# EAGLE design CapGrid4x4V1-partialroute2 (EAGLE 6.5.0)
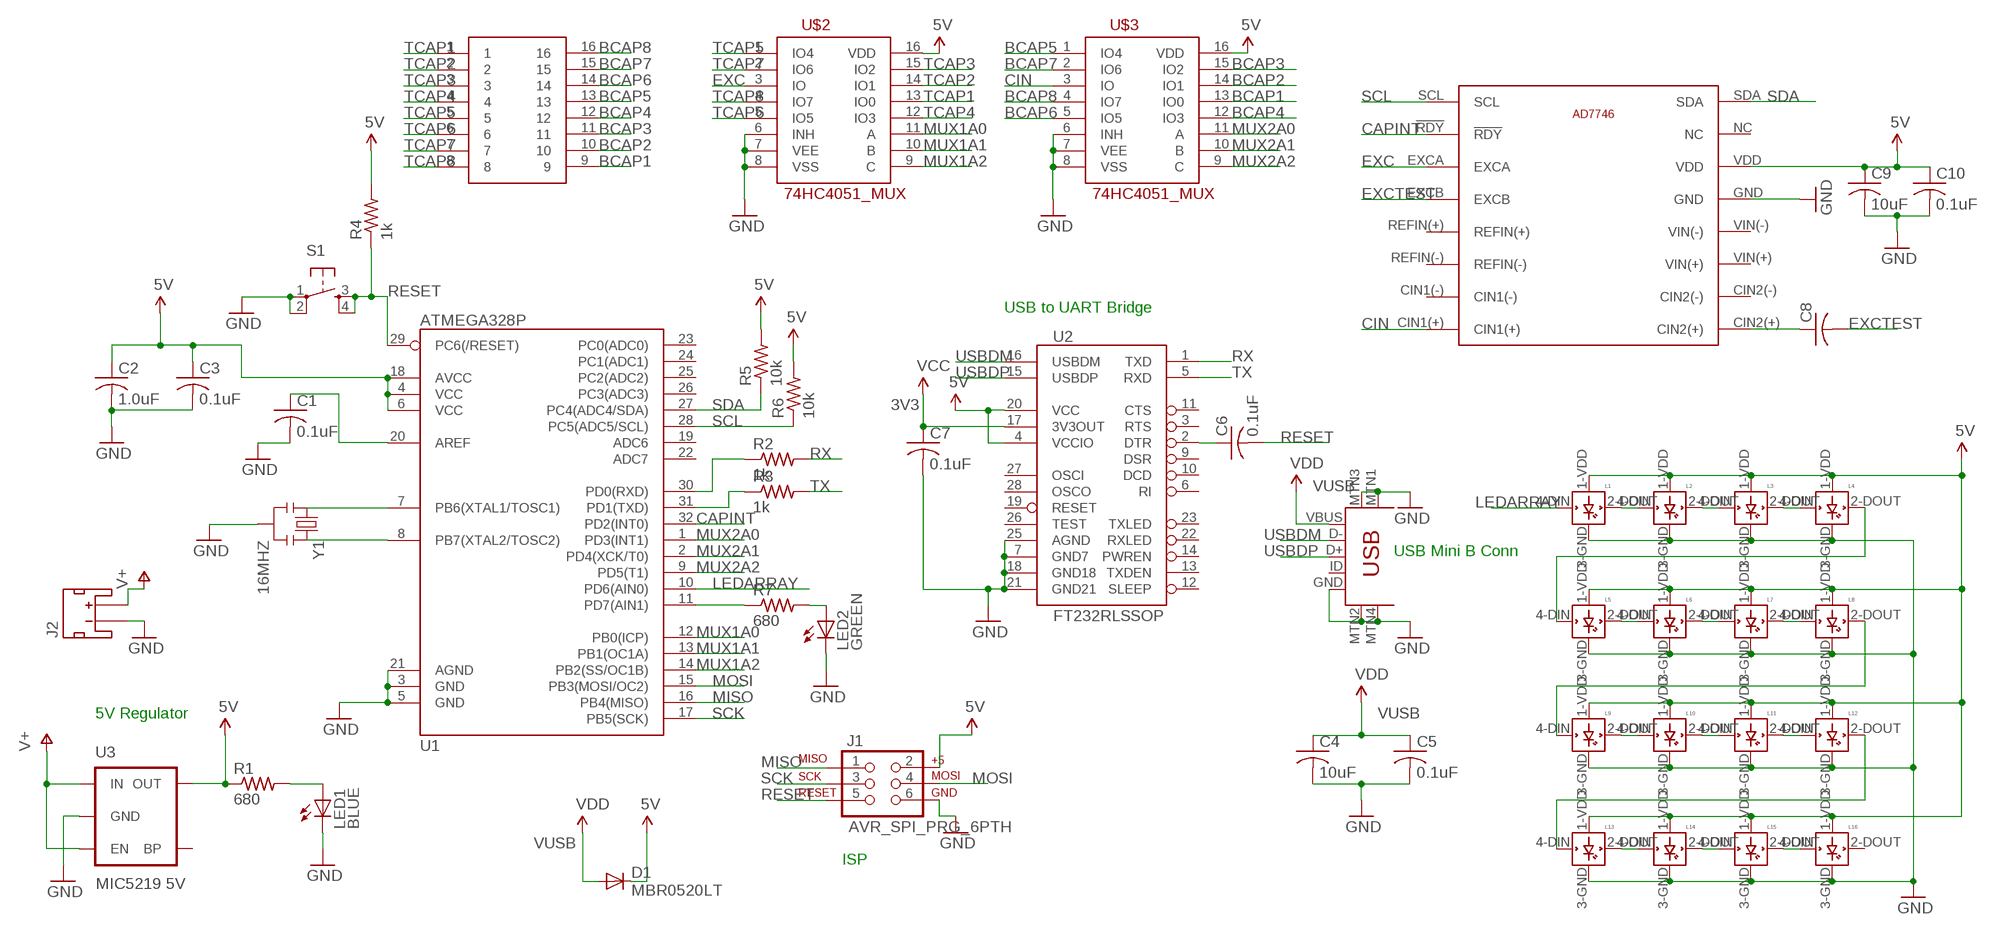
[diagram p0: schematic, sheet 1]

## Parts
C1  0.1uF  C-USC0805K  [C0805K]
C2  1.0uF  C-USC0805K  [C0805K]
C3  0.1uF  C-USC0805K  [C0805K]
C4  10uF  C-USC0805K  [C0805K]
C5  0.1uF  C-USC0805K  [C0805K]
C6  0.1uF  C-USC0805K  [C0805K]
C7  0.1uF  C-USC0805K  [C0805K]
C8  C-US025-025X050  [C025-025X050]
C9  10uF  C-USC0805K  [C0805K]
C10  0.1uF  C-USC0805K  [C0805K]
D1  MBR0520LT  [SOD123]
J1  AVR_SPI_PRG_6PTH  [2X3]
J2  JST_2MM_MALE  [JST-2-SMD]
L1  WS2812B  [WS2812B]
L2  WS2812B  [WS2812B]
L3  WS2812B  [WS2812B]
L4  WS2812B  [WS2812B]
L5  WS2812B  [WS2812B]
L6  WS2812B  [WS2812B]
L7  WS2812B  [WS2812B]
L8  WS2812B  [WS2812B]
L9  WS2812B  [WS2812B]
L10  WS2812B  [WS2812B]
L11  WS2812B  [WS2812B]
L12  WS2812B  [WS2812B]
L13  WS2812B  [WS2812B]
L14  WS2812B  [WS2812B]
L15  WS2812B  [WS2812B]
L16  WS2812B  [WS2812B]
LED1  BLUE  LEDCHIP-LED0805  [CHIP-LED0805]
LED2  GREEN  LEDCHIP-LED0805  [CHIP-LED0805]
R1  680  R-US_R0805  [R0805]
R2  1k  R-US_R0805  [R0805]
R3  1k  R-US_R0805  [R0805]
R4  1k  R-US_R0805  [R0805]
R5  10k  R-US_R0805  [R0805]
R6  10k  R-US_R0805  [R0805]
R7  680  R-US_R0805  [R0805]
S1  TAC_SWITCHSMD  [TACTILE-SWITCH-SMD]
U1  ATMEGA328P  ATMEGA328_SMT  [TQFP32-08]
U2  FT232RLSSOP  [SSOP28DB]
U3  MIC5219 5V  V_REG_MIC52195V  [SOT23-5]
U$1  USB-MINIB-5PIN  [USB-MINIB]
U$2  74HC4051_MUX  [SO16]
U$3  74HC4051_MUX  [SO16]
U$4  AD7746  [AD7746]
U$5  CAP8CONN  [CAP8CONN]
Y1  16MHZ  RESONATOR16MHZ  [RESONATOR-SMD]

## Nets
3V3: C7.1 U2.17(3V3OUT) ; supply symbol labelled VCC
5V: C2.1 C3.1 C9.1 C10.1 D1.C J1.2 L1.1-VDD(VDD) L2.1-VDD(VDD) L3.1-VDD(VDD) L4.1-VDD(VDD) L5.1-VDD(VDD) L6.1-VDD(VDD) L7.1-VDD(VDD) L8.1-VDD(VDD) L9.1-VDD(VDD) L10.1-VDD(VDD) L11.1-VDD(VDD) L12.1-VDD(VDD) L13.1-VDD(VDD) L14.1-VDD(VDD) L15.1-VDD(VDD) L16.1-VDD(VDD) R1.1 R4.2 R5.2 R6.2 U1.4(VCC) U1.6(VCC) U1.18(AVCC) U2.4(VCCIO) U2.20(VCC) U3.5(OUT) U$2.16(VDD) U$3.16(VDD) U$4.VDD
BCAP1: U$3.13(IO0) U$5.9
BCAP2: U$3.14(IO1) U$5.10
BCAP3: U$3.15(IO2) U$5.11
BCAP4: U$3.12(IO3) U$5.12
BCAP5: U$3.1(IO4) U$5.13
BCAP6: U$3.5(IO5) U$5.14
BCAP7: U$3.2(IO6) U$5.15
BCAP8: U$3.4(IO7) U$5.16
CAPINT: U1.32(PD2(INT0)) U$4.!RDY
CIN: U$3.3(IO) U$4.CIN1(+)
EXC: U$2.3(IO) U$4.EXCA
EXCTEST: C8.2 U$4.EXCB
GND: C1.2 C2.2 C3.2 C4.2 C5.2 C7.2 C9.2 C10.2 J1.6 J2.1(-) L1.3-GND(GND) L2.3-GND(GND) L3.3-GND(GND) L4.3-GND(GND) L5.3-GND(GND) L6.3-GND(GND) L7.3-GND(GND) L8.3-GND(GND) L9.3-GND(GND) L10.3-GND(GND) L11.3-GND(GND) L12.3-GND(GND) L13.3-GND(GND) L14.3-GND(GND) L15.3-GND(GND) L16.3-GND(GND) LED1.C LED2.C S1.1 S1.2 U1.3(GND) U1.5(GND) U1.21(AGND) U2.7(GND7) U2.18(GND18) U2.21(GND21) U2.25(AGND) U3.2(GND) U$1.GND U$1.MTN1(MTN2) U$1.MTN2(MTN3) U$1.MTN3(MTN1) U$1.MTN4 U$2.6(INH) U$2.7(VEE) U$2.8(VSS) U$3.6(INH) U$3.7(VEE) U$3.8(VSS) U$4.GND Y1.2
LEDARRAY: L1.4-DIN(DIN) U1.10(PD6(AIN0))
MISO: J1.1 U1.16(PB4(MISO))
MOSI: J1.4 U1.15(PB3(MOSI/OC2))
MUX1A0: U1.12(PB0(ICP)) U$2.11(A)
MUX1A1: U1.13(PB1(OC1A)) U$2.10(B)
MUX1A2: U1.14(PB2(SS/OC1B)) U$2.9(C)
MUX2A0: U1.1(PD3(INT1)) U$3.11(A)
MUX2A1: U1.2(PD4(XCK/T0)) U$3.10(B)
MUX2A2: U1.9(PD5(T1)) U$3.9(C)
N$1: R2.1 U1.30(PD0(RXD))
N$2: C6.1 U2.2(DTR)
N$3: R3.1 U1.31(PD1(TXD))
N$4: U1.7(PB6(XTAL1/TOSC1)) Y1.1
N$5: R7.1 U1.11(PD7(AIN1))
N$6: U1.8(PB7(XTAL2/TOSC2)) Y1.3
N$7: C1.1 U1.20(AREF)
N$8: LED1.A R1.2
N$9: LED2.A R7.2
N$10: L4.2-DOUT(DOUT) L5.4-DIN(DIN)
N$11: L10.2-DOUT(DOUT) L11.4-DIN(DIN)
N$14: L1.2-DOUT(DOUT) L2.4-DIN(DIN)
N$15: L2.2-DOUT(DOUT) L3.4-DIN(DIN)
N$16: L3.2-DOUT(DOUT) L4.4-DIN(DIN)
N$18: L5.2-DOUT(DOUT) L6.4-DIN(DIN)
N$19: L6.2-DOUT(DOUT) L7.4-DIN(DIN)
N$20: L7.2-DOUT(DOUT) L8.4-DIN(DIN)
N$21: L8.2-DOUT(DOUT) L9.4-DIN(DIN)
N$22: L9.2-DOUT(DOUT) L10.4-DIN(DIN)
N$24: L11.2-DOUT(DOUT) L12.4-DIN(DIN)
N$25: L12.2-DOUT(DOUT) L13.4-DIN(DIN)
N$26: L13.2-DOUT(DOUT) L14.4-DIN(DIN)
N$27: L14.2-DOUT(DOUT) L15.4-DIN(DIN)
N$28: L15.2-DOUT(DOUT) L16.4-DIN(DIN)
N$29: C8.1 U$4.CIN2(+)
RESET: C6.2 J1.5 R4.1 S1.3 S1.4 U1.29(PC6(/RESET))
RX: R2.2 U2.1(TXD)
SCK: J1.3 U1.17(PB5(SCK))
SCL: R6.1 U1.28(PC5(ADC5/SCL)) U$4.SCL
SDA: R5.1 U1.27(PC4(ADC4/SDA)) U$4.SDA
TCAP1: U$2.13(IO0) U$5.1
TCAP2: U$2.14(IO1) U$5.2
TCAP3: U$2.15(IO2) U$5.3
TCAP4: U$2.12(IO3) U$5.4
TCAP5: U$2.1(IO4) U$5.5
TCAP6: U$2.5(IO5) U$5.6
TCAP7: U$2.2(IO6) U$5.7
TCAP8: U$2.4(IO7) U$5.8
TX: R3.2 U2.5(RXD)
USBDM: U2.16(USBDM) U$1.D-
USBDP: U2.15(USBDP) U$1.D+
V+: J2.2(+) U3.1(IN) U3.3(EN)
VUSB: C4.1 C5.1 D1.A U$1.VBUS ; supply symbol labelled VDD
Unconnected: J2.NC1(PAD1) J2.NC2(PAD2) L16.2-DOUT(DOUT) U1.19(ADC6) U1.22(ADC7) U1.23(PC0(ADC0)) U1.24(PC1(ADC1)) U1.25(PC2(ADC2)) U1.26(PC3(ADC3)) U2.3(RTS) U2.6(RI) U2.9(DSR) U2.10(DCD) U2.11(CTS) U2.12(SLEEP) U2.13(TXDEN) U2.14(PWREN) U2.19(RESET) U2.22(RXLED) U2.23(TXLED) U2.26(TEST) U2.27(OSCI) U2.28(OSCO) U3.4(BP) U$1.ID U$4.CIN1(-) U$4.CIN2(-) U$4.NC U$4.REFIN(+) U$4.REFIN(-) U$4.VIN(+) U$4.VIN(-)

## Notes on the sheet
- USB to UART Bridge
- USB Mini B Conn
- 5V Regulator
- ISP

## Library data of the parts
C1 C3 C5-C7 C10 = adafruit:C-US: CAPACITOR, American symbol; MPN: 08055C104KAZ2A; OC_NEWARK: 10R5976
C2 = adafruit:C-US: CAPACITOR, American symbol; MF: KEMET; MPN: C0805C105M4RACTU; OC_NEWARK: 42H5473
C4 C9 = adafruit:C-US: CAPACITOR, American symbol; MPN: C2012X5R1A106K125AB; OC_NEWARK: 04X3268
C8 = adafruit:C-US: CAPACITOR, American symbol; OC_NEWARK: unknown
D1 = diode:MBR0520LT: SCHOTTKY BARRIER RECTIFIER Source: http://onsemi.com .. MBR0520LT1-D.pdf; MF: ON SEMICONDUCTOR; MPN: MBR0520LT1G; OC_NEWARK: 48K7498
J1 = SparkFun-Connectors:AVR_SPI_PRG_6: AVR ISP 6 Pin This is the reduced ISP connector for AVR programming. Common on Arduino. This footprint will take up less PCB space and can be used with a 10-pin to 6-pin adapter such as SKU: BOB-08508 **Special note about "TEST_POINT" package. The stop mask is on the top side, so if you want your programming test points to be on the bottom of your board, make sure to place this package on the bottom side of the board. This also ensure that the orientation to program from the bottom side will be correct.; OC_NEWARK: unknown
J2 = SparkFun-Connectors:JST_2MM_MALE: Mates to single-cell LiPo batteries. CONN-08352; MF: FARNELL; MPN: S2B-PH-SM4-TB(LF)(SN); OC_NEWARK: 38K8067; PROD_ID: CONN-08352
L1-L16 = adafruit:WS2812B; OC_NEWARK: unknown
LED1 = adafruit:LED: LED OSRAM: - CHIPLED LG R971, LG N971, LY N971, LG Q971, LY Q971, LO R971, LY R971 LH N974, LH R974 LS Q976, LO Q976, LY Q976 LO Q996 - Hyper CHIPLED LW Q18S LB Q993, LB Q99A, LB R99A - SideLED LS A670, LO A670, LY A670, LG A670, LP A670 LB A673, LV A673, LT A673, LW A673 LH A674 LY A675 LS A676, LA A676, LO A676, LY A676, LW A676 LS A679, LY A679, LG A679 - Hyper Micro SIDELED® LS Y876, LA Y876, LO Y876, LY Y876 LT Y87S - SmartLED LW L88C, LW L88S LB L89C, LB L89S, LG L890 LS L89K, LO L89K, LY L89K LS L896, LA L896, LO L896, LY L896 - TOPLED LS T670, LO T670, LY T670, LG T670, LP T670 LSG T670, LSP T670, LSY T670, LOP T670, LYG T670 LG T671, LOG T671, LSG T671 LB T673, LV T673, LT T673, LW T673 LH T674 LS T676, LA T676, LO T676, LY T676, LB T676, LH T676, LSB T676, LW T676 LB T67C, LV T67C, LT T67C, LS T67K, LO T67K, LY T67K, LW E67C LS E67B, LA E67B, LO E67B, LY E67B, LB E67C, LV E67C, LT E67C LW T67C LS T679, LY T679, LG T679 LS T770, LO T770, LY T770, LG T770, LP T770 LB T773, LV T773, LT T773, LW T773 LH T774 LS E675, LA E675, LY E675, LS T675 LS T776, LA T776, LO T776, LY T776, LB T776 LHGB T686 LT T68C, LB T68C - Hyper Mini TOPLED® LB M676 - Mini TOPLED Santana® LG M470 LS M47K, LO M47K, LY M47K Source: http://www.osram.convergy.de/; MF: SLI (CML/IDI); MPN: CMD17-21VRC/TR8; OC_NEWARK: 34C8663
LED2 = adafruit:LED: LED OSRAM: - CHIPLED LG R971, LG N971, LY N971, LG Q971, LY Q971, LO R971, LY R971 LH N974, LH R974 LS Q976, LO Q976, LY Q976 LO Q996 - Hyper CHIPLED LW Q18S LB Q993, LB Q99A, LB R99A - SideLED LS A670, LO A670, LY A670, LG A670, LP A670 LB A673, LV A673, LT A673, LW A673 LH A674 LY A675 LS A676, LA A676, LO A676, LY A676, LW A676 LS A679, LY A679, LG A679 - Hyper Micro SIDELED® LS Y876, LA Y876, LO Y876, LY Y876 LT Y87S - SmartLED LW L88C, LW L88S LB L89C, LB L89S, LG L890 LS L89K, LO L89K, LY L89K LS L896, LA L896, LO L896, LY L896 - TOPLED LS T670, LO T670, LY T670, LG T670, LP T670 LSG T670, LSP T670, LSY T670, LOP T670, LYG T670 LG T671, LOG T671, LSG T671 LB T673, LV T673, LT T673, LW T673 LH T674 LS T676, LA T676, LO T676, LY T676, LB T676, LH T676, LSB T676, LW T676 LB T67C, LV T67C, LT T67C, LS T67K, LO T67K, LY T67K, LW E67C LS E67B, LA E67B, LO E67B, LY E67B, LB E67C, LV E67C, LT E67C LW T67C LS T679, LY T679, LG T679 LS T770, LO T770, LY T770, LG T770, LP T770 LB T773, LV T773, LT T773, LW T773 LH T774 LS E675, LA E675, LY E675, LS T675 LS T776, LA T776, LO T776, LY T776, LB T776 LHGB T686 LT T68C, LB T68C - Hyper Mini TOPLED® LB M676 - Mini TOPLED Santana® LG M470 LS M47K, LO M47K, LY M47K Source: http://www.osram.convergy.de/; MF: SLI (CML/IDI); MPN: CMD17-21VGC/TR8; OC_NEWARK: 34C8661
R1 R7 = adafruit:R-US_: RESISTOR, American symbol; MPN: ERJ-6ENF6800V; OC_NEWARK: 64R5419
R2-R4 = adafruit:R-US_: RESISTOR, American symbol; MF: VISHAY/DALE; MPN: CRCW08051K00FKTA; OC_NEWARK: 05F1507
R5 R6 = adafruit:R-US_: RESISTOR, American symbol; MF: VISHAY/DALE; MPN: CRCW080510K0FKEA; OC_NEWARK: 52K9795
S1 = SparkFun-Electromechanical:TAC_SWITCH: Momentary Switch Button commonly used for reset or general input. Spark Fun Electronics SKU : COM-00097 SMT- SWCH-08247; MPN: MC32845; OC_NEWARK: 67P3626
U1 = SparkFun-DigitalIC:ATMEGA328_SMT: 32-Pin Atmega328 part Commonly used on Arduino compatible boards Available in QFP and QFN packages TQFP is IC-09069 QFN is non-stock; MPN: ATMEGA328P-AU; OC_NEWARK: 68T2935; PROD_ID: IC-09069
U2 = SparkFun-DigitalIC:FT232RL: USB UART FT232RL 4th Generation USB UART (USB <-> Serial) Controller. Spark Fun Electronics SKU : COM-00650 Production SKU IC-00870; MPN: FT232RL; OC_NEWARK: 91K9918; PROD_ID: IC-00870
U3 = SparkFun-PowerIC:V_REG_MIC5219: V_REG MIC5219 Standard 3.3V and 5V 500mA LDO voltage regulator in SOT-23 layout. Micrel part MIC5219. BP (by-pass) pin is used to lower output noise with 470pF cap, may be left open.; OC_NEWARK: unknown; PROD_ID: VREG-10107
U$1 = SparkFun-Connectors:USB-MINIB: Mini-USB "B" connector with 5th pin broken out. Created new symbol breaking out 5th "ID" pin in mini/micro USB connector spec. See: http://en.wikipedia.org/wiki/Mini_usb#Cables. Uses same footprint as 4-pin symbol. Also added pins to connect to mounting / shield pads if required (probably not generally needed as signals aren't shielded once they leave the connector).; MPN: 67503-1230; OC_NEWARK: 88W2531
U$2 U$3 = SparkFun-AnalogIC:74HC4051_MUX: 8:1 analog mux; OC_NEWARK: unknown
U$4 = SBLib:AD7746; MPN: AD7746ARUZ; OC_NEWARK: 19M0895
U$5 = SBLib:CAP8CONN; OC_NEWARK: unknown
Y1 = SparkFun-FreqCtrl:RESONATOR: Resonator Small SMD resonator. Used, eg, on the Arduino Pro/ Pro Mini boards. 8MHz- XTAL-08895 16MHz- XTAL-08900; MPN: PBRC16.00MR70X000; OC_NEWARK: 11N7357; PROD_ID: XTAL-08900

## Net classes
0 default: width 0.152 mm, drill 0.33 mm, clearance 0.178 mm

## Board
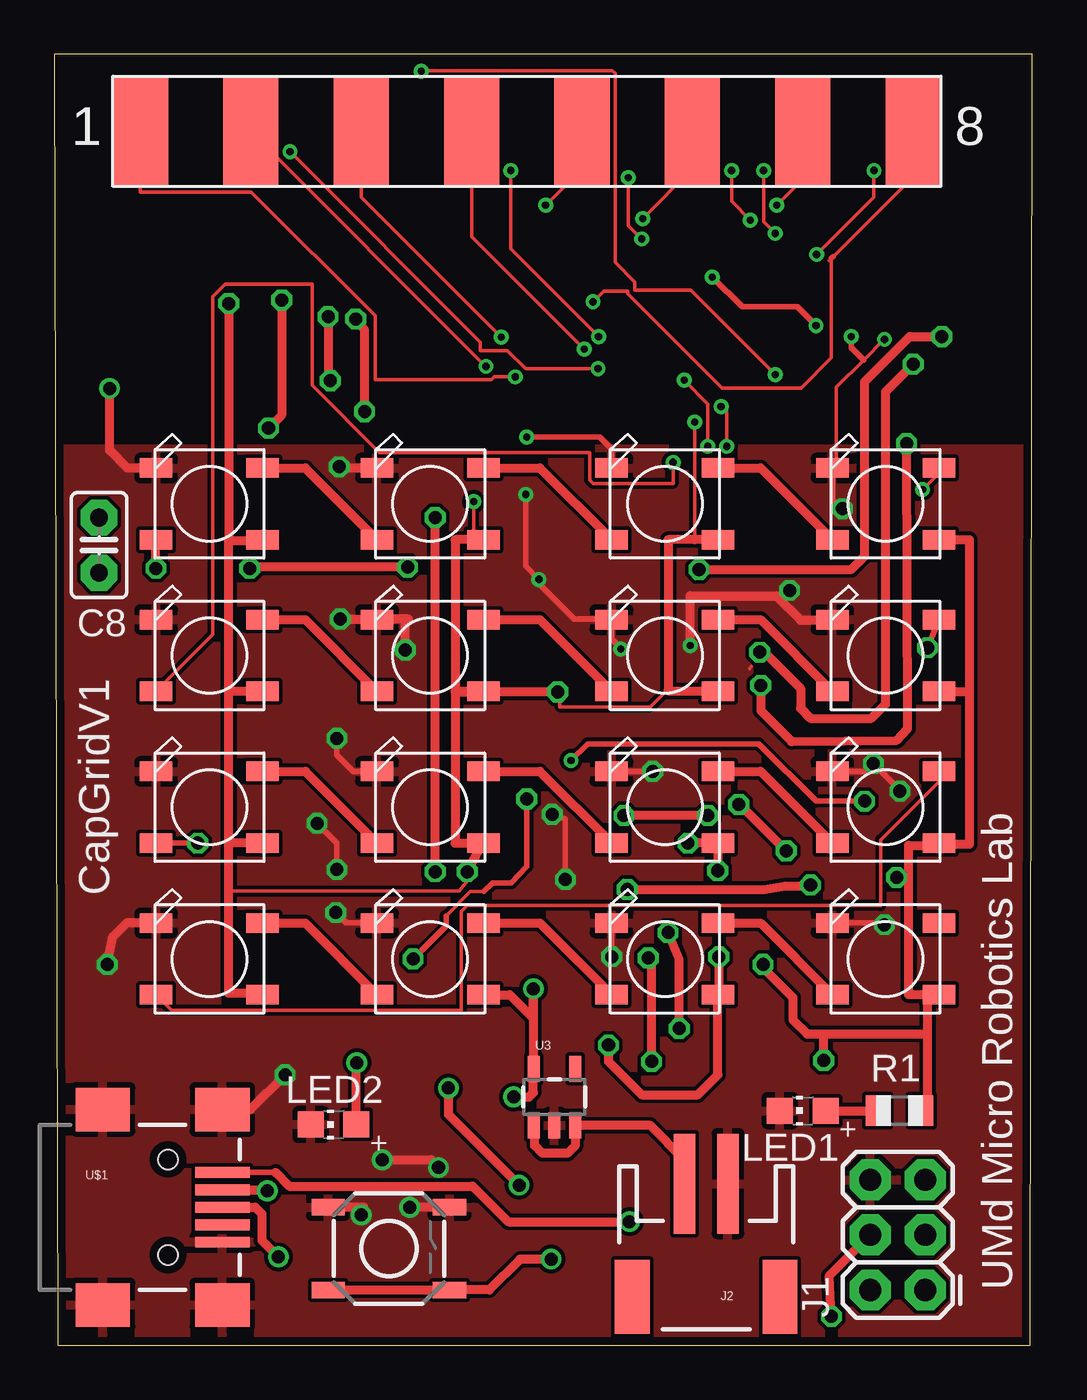
[diagram p1: board, top side]
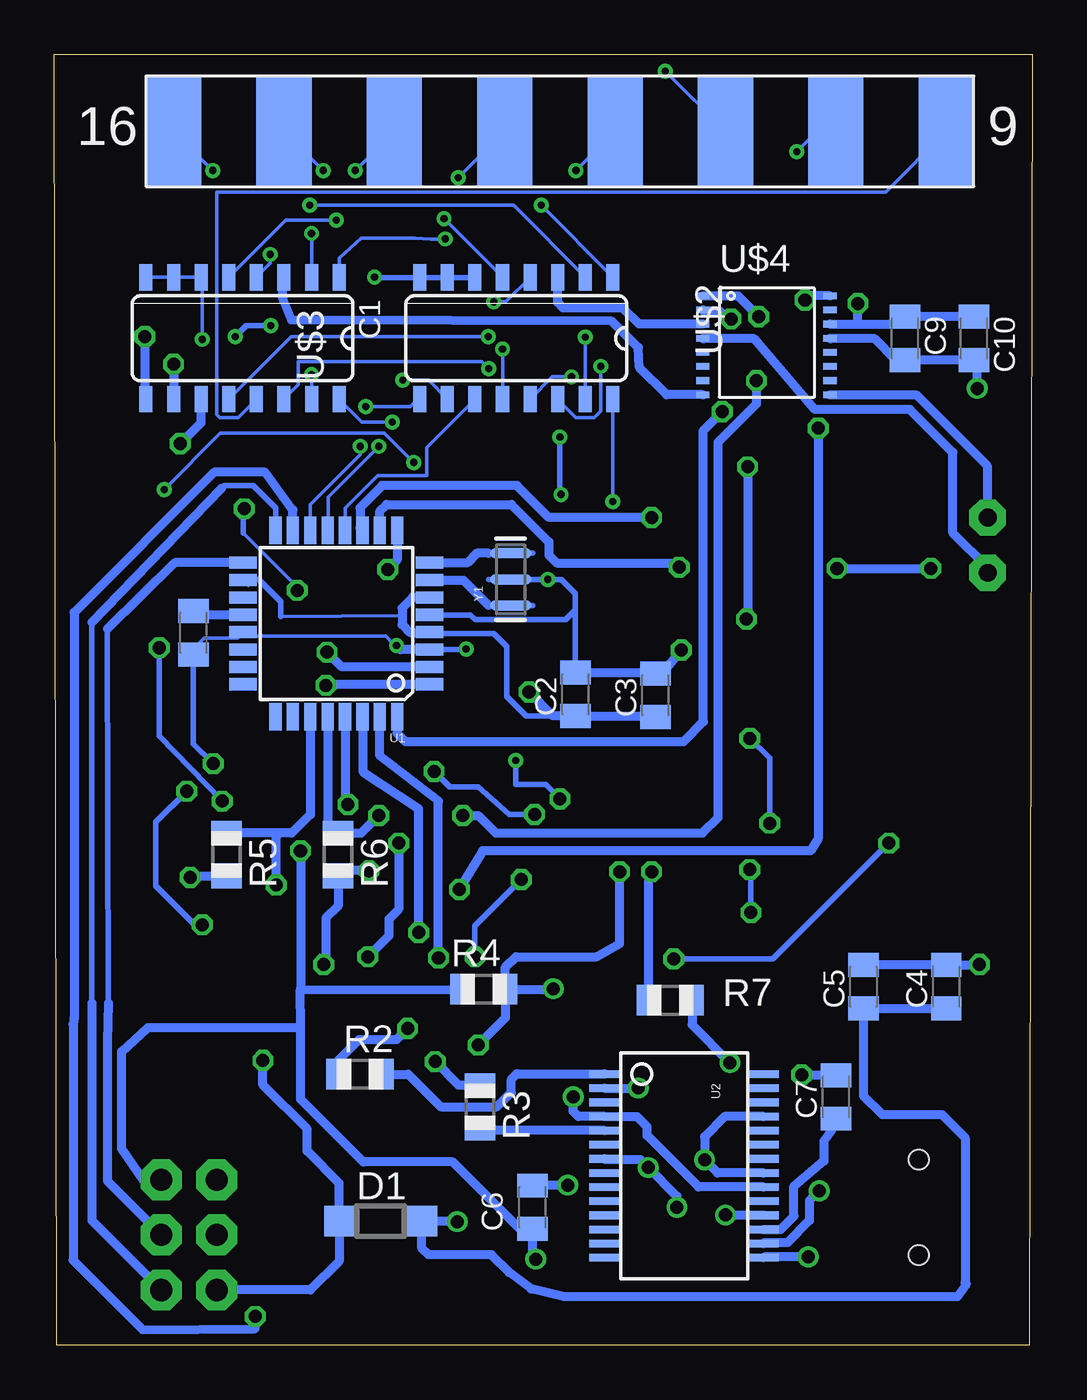
[diagram p2: board, bottom side, seen from below]

Size 45.01 x 59.43 mm. Coordinates in mm from the lower left corner, seen from the top.
Outline: 0.15,0 44.91,0 45.01,59.43 0,59.43 0.15,0
Copper layers (1*16): Top 0.0356mm / dielectric 1.5011mm / Bottom 0.0356mm
Design rules "LaenPCBOrder": minimum track width 6mil, minimum drill 13mil, track to track 6mil, track to pad 6mil, pad to pad 6mil, via to via 6mil, smd to smd 6mil, copper to edge 15mil, drill to drill 6mil, minimum pad ring 7mil, minimum via ring 7mil, stop-mask expansion 3mil, vias tented up to drill 0mil, thermal gap 10mil

### Footprints (pad centres in the part's own frame; a part is rotated, then mirrored left to right if it is on the bottom)
C0805K = smd 1.1 x 1.4: 1 -1,0; 2 1,0
C025-025X050 = drill 0.813 pad 1.676 octagon: 1 -1.27,0; 2 1.27,0
SOD123 = smd 1.4 x 1.4: A 1.9,0; C -1.9,0
2X3 = drill 1.016 pad 1.88 octagon: 1 0,0; 2 0,2.54; 3 2.54,0; 4 2.54,2.54; 5 5.08,0; 6 5.08,2.54
JST-2-SMD = smd 1 x 4.6: 1 -1,-3.7; 2 1,-3.7 | smd 1.6 x 3.4: NC1 -3.4,1.5; NC2 3.4,1.5
WS2812B = smd 1.5 x 0.9: 1-VDD 2.45,-1.65; 2-DOUT 2.45,1.65; 3-GND -2.45,1.65; 4-DIN -2.45,-1.65
CHIP-LED0805 = smd 1.2 x 1.2: A 0,-1.05; C 0,1.05
R0805 = smd 1.1 x 1.4: 1 -1,0; 2 1,0
TACTILE-SWITCH-SMD = smd 1.524 x 0.762: 1 -2.794,1.905; 2 2.794,1.905; 3 -2.794,-1.905; 4 2.794,-1.905
TQFP32-08 = smd 1.27 x 0.559: 1 -4.293,2.8; 2 -4.293,2; 3 -4.293,1.2; 4 -4.293,0.4; 5 -4.293,-0.4; 6 -4.293,-1.2; 7 -4.293,-2; 8 -4.293,-2.8; 17 4.293,-2.8; 18 4.293,-2; 19 4.293,-1.2; 20 4.293,-0.4; 21 4.293,0.4; 22 4.293,1.2; 23 4.293,2; 24 4.293,2.8 | smd 0.559 x 1.27: 9 -2.8,-4.293; 10 -2,-4.293; 11 -1.2,-4.293; 12 -0.4,-4.293; 13 0.4,-4.293; 14 1.2,-4.293; 15 2,-4.293; 16 2.8,-4.293; 25 2.8,4.293; 26 2,4.293; 27 1.2,4.293; 28 0.4,4.293; 29 -0.4,4.293; 30 -1.2,4.293; 31 -2,4.293; 32 -2.8,4.293
SSOP28DB = smd 0.348 x 1.397: 1 -4.225,-3.656; 2 -3.575,-3.656; 3 -2.925,-3.656; 4 -2.275,-3.656; 5 -1.625,-3.656; 6 -0.975,-3.656; 7 -0.325,-3.656; 8 0.325,-3.656; 9 0.975,-3.656; 10 1.625,-3.656; 11 2.275,-3.656; 12 2.925,-3.656; 13 3.575,-3.656; 14 4.225,-3.656; 15 4.225,3.656; 16 3.575,3.656; 17 2.925,3.656; 18 2.275,3.656; 19 1.625,3.656; 20 0.975,3.656; 21 0.325,3.656; 22 -0.325,3.656; 23 -0.975,3.656; 24 -1.625,3.656; 25 -2.275,3.656; 26 -2.925,3.656; 27 -3.575,3.656; 28 -4.225,3.656
SOT23-5 = smd 0.55 x 1.2: 1 -0.95,-1.3; 2 0,-1.3; 3 0.95,-1.3; 4 0.95,1.3; 5 -0.95,1.3
USB-MINIB = smd 2.5 x 0.5: D+ 2.5,0; D- 2.5,0.8; GND 2.5,-1.6; ID 2.5,-0.8; VBUS 2.5,1.6 | smd 2.5 x 2: MTN1 -3,4.5; MTN2 2.5,4.5; MTN3 -3,-4.5; MTN4 2.5,-4.5 | hole 0.9: 0,2.2; 0,-2.2
SO16 = smd 0.6 x 1.2: 1 -4.445,-2.8; 2 -3.175,-2.8; 3 -1.905,-2.8; 4 -0.635,-2.8; 5 0.635,-2.8; 6 1.905,-2.8; 7 3.175,-2.8; 8 4.445,-2.8; 9 4.445,2.8; 10 3.175,2.8; 11 1.905,2.8; 12 0.635,2.8; 13 -0.635,2.8; 14 -1.905,2.8; 15 -3.175,2.8; 16 -4.445,2.8
AD7746 = smd 0.61 x 0.305: !RDY -2.95,1.3; CIN1(+) -2.95,-2.6; CIN1(-) -2.95,-1.95; CIN2(+) 2.9,-2.6; CIN2(-) 2.9,-1.95; EXCA -2.95,0.65; EXCB -2.95,0; GND 2.9,0; NC 2.9,1.3; REFIN(+) -2.95,-0.65; REFIN(-) -2.95,-1.3; SCL -2.95,1.95; SDA 2.9,1.95; VDD 2.9,0.65; VIN(+) 2.9,-1.3; VIN(-) 2.9,-0.65
CAP8CONN = smd 2.54 x 5.08: 1 -15.24,0; 2 -10.16,0; 3 -5.08,0; 4 0,0; 5 5.08,0; 6 10.16,0; 7 15.24,0; 8 20.32,0 | smd 2.54 x 5.08 bottom: 9 -15.24,0; 10 -10.16,0; 11 -5.08,0; 12 0,0; 13 5.08,0; 14 10.16,0; 15 15.24,0; 16 20.32,0
RESONATOR-SMD = smd 0.45 x 1.905: 1 -1.2,0; 2 0,0; 3 1.2,0

### Placement (x,y rotation side)
C1  38.61,32.79 270 bottom
C2  21.03,29.97 90 bottom
C3  17.35,29.92 90 bottom
C4  3.96,16.51 90 bottom
C5  7.77,16.51 90 bottom
C6  23.01,6.35 270 bottom
C7  9.04,11.43 90 bottom
C8  2.06,36.83 270 top
C9  5.87,46.35 270 bottom
C10  2.69,46.35 270 bottom
D1  30,5.71 0 bottom
J1  40.08,2.54 90 top
J2  30,3.73 180 top
L1  7.14,38.73 0 top
L2  17.3,38.73 0 top
L3  28.09,38.73 0 top
L4  38.25,38.73 0 top
L5  7.14,31.75 0 top
L6  17.3,31.75 0 top
L7  28.09,31.75 0 top
L8  38.25,31.75 0 top
L9  7.14,24.77 0 top
L10  17.3,24.77 0 top
L11  28.09,24.77 0 top
L12  38.25,24.77 0 top
L13  7.14,17.78 0 top
L14  17.3,17.78 0 top
L15  28.09,17.78 0 top
L16  38.25,17.78 0 top
LED1  34.44,10.79 90 top
LED2  12.85,10.16 90 top
R1  38.89,10.79 180 top
R2  30.94,12.47 0 bottom
R3  25.43,10.97 270 bottom
R4  25.25,16.38 0 bottom
R5  37.08,22.58 270 bottom
R6  31.95,22.58 270 bottom
R7  16.66,15.88 0 bottom
S1  15.39,4.45 0 top
U1  32.03,33.22 180 bottom
U2  16.03,8.26 270 bottom
U3  23.01,11.43 0 top
U$1  5.23,6.35 0 top
U$2  23.75,46.35 180 bottom
U$3  36.35,46.35 180 bottom
U$4  12.22,46.35 0 bottom
U$5  19.2,55.88 0 top
Y1  24,35.26 90 bottom

### Tracks (layer width: path | path; a pad name or v marks a point on that pad's centre or on a via)
3V3
  Bottom 0.406: C7.1 9.04,10.16 9.6,9.4 9.6,8.48 10.97,7.32 10.97,5.94 11.59,5.33 U2.17
5V  (via drill 0.33, 0.6)
  Top 0.152: 29.46,37.09 v29.46,42.49 | v19.3,38.84 19.3,37.29 L2.1-VDD | 28.24,30.12 28.07,30.02 27.43,29.39 23.27,29.39 23.27,29.9 v23.16,30.07 | 8.03,20.9 18.64,20.9 19.02,21.39 v19,21.79
  Top 0.406: L14.1-VDD 20.95,16.13 22.05,15.04 v22.05,16.41 22.05,12.74 U3.5 22.05,12.71 22.05,11.63 21.84,11.43 v21.13,11.43 | L5.1-VDD 8.03,30.1 | 8.03,30.1 8.03,37.03 | 8.03,37.03 9.59,37.03 L1.1-VDD | L9.1-VDD 8.03,23.11 | 8.03,23.11 8.03,30.1 | L13.1-VDD 9.45,16.13 9.45,16.2 8.03,16.2 8.03,20.9 8.03,23.11 | v8.03,47.95 8.03,37.03 | L2.1-VDD 18.44,37.09 18.44,30.07 19.75,30.07 L6.1-VDD | L6.1-VDD 18.44,30.1 18.44,23.11 L10.1-VDD 19.66,23.03 v19,21.79 | v29.16,23.11 L11.1-VDD 30.53,23.11 v30.53,21.84 | v30.58,17.88 30.58,16.17 L15.1-VDD 30.53,16.12 30.53,12.45 29.62,11.53 27.03,11.53 25.5,13.06 v25.5,13.82 | L16.1-VDD 40.18,16.13 | 40.18,16.13 39.32,16.13 39.32,21.69 | 39.32,21.69 39.32,23.01 40.7,23.01 L12.1-VDD 40.7,23.06 42.11,23.06 42.11,30.1 | L8.1-VDD 42.11,30.1 | L4.1-VDD 42.11,37.09 42.11,30.1 | R1.1 40.18,10.79 40.18,14.43 | 40.18,14.43 40.18,16.13 | L3.1-VDD 29.46,37.09 28.24,37.09 28.24,30.12 30.54,30.12 L7.1-VDD | v32.61,17.53 32.61,17.37 33.99,16 33.99,14.99 34.65,14.33 35.46,14.33 | 35.46,14.33 40.08,14.33 40.18,14.43 | v38.76,21.54 39.17,21.54 39.32,21.69 | v23.16,30.07 19.77,30.07 L6.1-VDD | v35.41,13.11 35.41,14.28 35.46,14.33
  Bottom 0.152: v29.46,42.49 30.86,42.49 31.9,43.54 U$3.16 | v19.3,38.84 U$2.16 | 36.09,34.98 36.32,35.2 U1.18 | 34.59,33.55 28.98,33.58 29.01,33.93
  Bottom 0.254: 34.59,33.55 34.59,34.24 35.61,35.26 36.29,35.26 U1.18 | C2.1 23.28,28.97 24.18,29.87 24.18,32.16 24.79,32.77 27.68,32.77 U1.4
  Bottom 0.406: J1.2 33.22,2.54 31.9,3.87 D1.C 31.9,7.46 33.38,8.94 33.38,9.96 35.41,11.99 v35.41,13.11 | C10.1 C9.1 6.22,47.01 U$4.VDD 8.03,47.01 v8.03,47.95 | R4.2 22.38,16.38 v22.05,16.41 | v21.13,11.43 21.13,10.77 20.89,10.53 U2.4 19.67,10.52 18.19,10.52 17.73,10.06 17.73,9.65 15.36,7.28 U2.20 | C3.1 17.4,28.97 C2.1 22.06,28.97 v23.16,30.07 | U1.4 27.74,32.82 28.65,32.82 29.01,33.17 29.01,33.93 28.52,34.42 U1.6 | v29.16,23.11 29.16,20.07 29.62,19.61 29.62,18.85 v30.58,17.88 | R4.2 24.25,17.41 23.77,17.88 20.07,17.88 19,18.49 v19,21.79 | R4.2 24.25,15.07 v25.5,13.82 | v30.53,21.84 31.69,21.84 R6.2 31.95,20.22 32.51,19.66 32.51,17.63 v32.61,17.53 | R5.2 38.72,21.58 v38.76,21.54
BCAP1
  Bottom 0.152: U$5.9 6.76,53.09 37.54,53.09 37.54,42.85 37.39,42.7 36.55,42.7 35.71,43.54 U$3.13
BCAP2  (via drill 0.33)
  Top 0.152: v25.02,44.96 21.69,44.96 20.85,45.8 19.61,45.8 19.61,46.18 v10.85,54.94
  Bottom 0.152: v25.02,44.96 25.35,45.29 33.78,45.29 33.78,44.22 U$3.14 | v10.85,54.94 9.91,55.88 U$5.10
BCAP3  (via drill 0.33)
  Top 0.152: v33.17,44.68 29.29,48.56 26.72,48.56 26.72,48.95 25.81,49.86 25.81,58.55 25.68,58.67 16.89,58.67 v16.89,58.65
  Bottom 0.152: v33.17,44.68 U$3.15 | U$5.11 v16.89,58.65
BCAP4  (via drill 0.33)
  Top 0.152: v25.04,46.43 21.01,50.47 v21.01,54.08
  Bottom 0.152: v25.04,46.43 34.11,46.43 U$3.12 | U$5.12 v21.01,54.08
BCAP5  (via drill 0.33)
  Top 0.152: v27.03,50.93 26.42,51.54 v26.42,53.75
  Bottom 0.152: v27.03,50.93 27.69,50.93 28.42,50.95 30.89,50.95 31.9,50.04 U$3.1 | U$5.13 v26.42,53.75
BCAP6  (via drill 0.33)
  Top 0.152: v32.03,51.79 31.17,52.65 v31.17,54.08
  Bottom 0.152: v32.03,51.79 34.37,51.79 36.98,49.17 U$3.5 | U$5.14 v31.17,54.08
BCAP7  (via drill 0.33)
  Top 0.152: v33.17,51.18 32.64,51.71 v32.64,54.08
  Bottom 0.152: v33.17,51.18 U$3.2 | U$5.15 v32.64,54.08
BCAP8  (via drill 0.33)
  Top 0.152: v35.08,50.22 37.72,52.86 v37.72,54.08
  Bottom 0.152: v35.08,50.22 35.08,49.81 35.71,49.17 U$3.4 | U$5.16 v37.72,54.08
CAPINT  (via drill 0.6)
  Top 0.406: v14.27,42.98 14.27,46.74 v13.87,47.24
  Bottom 0.406: U1.32 29.23,28.16 28.85,27.79 16.05,27.79 15.14,28.7 15.14,42.11 v14.27,42.98 | v13.87,47.24 13.92,47.14 14.38,47.6 15.11,47.6 U$4.!RDY
CIN
  Bottom 0.406: U$4.CIN1(+) 16.83,43.76 18.08,45.01 18.14,45.92 19.35,47.14 34.09,47.19 34.49,48.21 34.49,49.1 U$3.3
EXC
  Bottom 0.406: U$4.EXCA 18.1,47.01 18.85,47.75 21.59,47.75 21.84,48.01 U$2.3
EXCTEST
  Bottom 0.406: C8.2 2.06,35.79 3.66,37.39 3.66,41.1 5.64,43.08 10.01,43.08 12.8,46.33 15.14,46.33 U$4.EXCB
GND  (via drill 0.33, 0.6)
  Top 0.152: v38.2,46.3 37.25,45.35 35.99,44.09 35.99,40.56 35.81,40.39 L4.3-GND | L8.3-GND 35.81,33.4 35.78,33.38 | 32.08,31.24 31.99,31.16 | 29.13,32.41 v29.26,32.21
  Top 0.254: L12.3-GND 37.29,26.42 37.64,26.77 v37.69,26.77 38.91,25.55 v38.91,25.5 | L16.3-GND 38.13,19.43 v38.2,19.36 | L14.3-GND 13.44,19.43 v12.95,19.91 | v13,21.89 13,23.11 v12.09,24.03 | v13,27.94 13,27.18 13.77,26.42 L10.3-GND | L15.3-GND 25.64,17.89 v25.65,17.88 | v23.52,21.44 23.52,24.23 v22.91,24.43 | v27.53,26.42 L11.3-GND | 33.22,34.49 33.58,34.49 v33.83,34.75 | v36.27,38.51 36.22,38.51 35.81,38.91 35.81,40.37 L4.3-GND | v30.28,49.17 31.65,47.8 34.19,47.8 v35.05,46.94 | v36.68,46.43 36.68,45.92 37.25,45.35 | L3.3-GND 25.64,41.26 25.1,41.81 v21.74,41.81 | v21.69,39.17 21.69,35.87 v22.3,35.26 22.3,35.05 23.93,33.43 25.62,33.43 L7.3-GND 25.65,33.39 25.65,32.51 26.06,32.11 v26.06,32.05
  Top 0.406: L1.3-GND 3.35,40.38 2.54,41.2 v2.54,44.04 | v14.12,5.99 14.12,6.25 14.22,6.35 S1.1 | S1.2 v16.36,6.35 | v15.09,8.53 17.32,8.53 v17.68,8.18 | U$1.MTN2 9.02,10.85 v10.62,12.45 | v29.26,32.21 29.26,34.49 33.22,34.49 34.34,33.38 35.78,33.38 L8.3-GND | v2.44,17.53 2.69,18.8 3.35,19.46 4.66,19.46 L13.3-GND | L2.3-GND 13.16,40.38 v13.11,40.44 | v13.16,33.43 14.82,33.43 L6.3-GND 14.87,33.43 16.31,33.43 16.15,33.27 v16.15,32
  Bottom 0.152: C1.2 39.12,31.55 38.1,32.56 36.58,32.56 U1.21 36.27,32.77 36.14,32.64 29.77,32.64 29.44,32.31 v29.26,32.21 | U$3.8 40.79,49.17 39.57,49.17 U$3.7 39.52,49.17 38.25,49.17 U$3.6 38.2,49.1 v38.2,46.3 | U$2.6 25.65,49.17 26.92,49.17 U$2.7 26.97,49.17 28.19,49.17 U$2.8 | 33.83,34.9 36.32,37.39
  Bottom 0.254: C1.2 38.61,27.69 v37.69,26.77 | v38.2,19.36 38.56,19.36 40.34,21.13 40.34,24.08 v38.91,25.5 | v12.95,19.91 12.95,21.84 v13,21.89 | v12.09,24.03 12.09,27.03 v13,27.94 | v25.65,17.88 25.65,19.3 v23.52,21.44 | v22.91,24.43 24.08,24.43 25.5,25.7 26.82,25.7 v27.53,26.42 | v33.83,34.75 33.83,34.9 | 36.32,37.39 36.32,38.46 v36.27,38.51 | C2.2 21.03,33.83 | 21.03,33.83 21.03,34.59 21.69,35.26 v22.3,35.26 22.99,35.26 25.02,35.26 | U1.5 25.87,33.62 L7.3-GND 21.46,33.4 21.03,33.83 | U$2.6 30.28,49.16 v30.28,49.17 | v35.05,46.94 36.17,46.94 v36.68,46.43 | v21.74,41.81 21.74,39.22 v21.69,39.17 | U1.3 26.09,32.02 v26.06,32.05
  Bottom 0.406: C5.2 C4.2 2.78,17.51 v2.44,17.53 | U$4.GND 9.29,46.33 7.26,46.33 6.29,45.35 C9.2 C10.2 2.54,45.2 v2.54,44.04 | U2.18 14.11,5.98 v14.12,5.99 | v16.36,6.35 16.36,6.86 v17.68,8.18 18.03,8.53 19.64,8.53 U2.7 | U2.21 14.48,7.93 v15.09,8.53 15.09,9.6 14.16,10.53 U2.25 | C2.2 17.4,30.97 | 17.4,30.97 C3.2 | v10.62,12.45 9.06,12.45 C7.2 | U1.3 29.08,32.02 v29.26,32.21 | v13.11,40.44 13.11,33.48 v13.16,33.43 | 17.4,30.97 16.98,30.97 v16.15,32
  pour Top: -0.48,41.27 45.87,41.27 45.87,-0.64 -0.48,-0.64
LEDARRAY  (via drill 0.6)
  Top 0.406: v16.26,35.81 9.04,35.81 v8.99,35.76 | v4.67,35.76 4.67,37.07 L1.4-DIN
  Bottom 0.406: U1.10 30.03,38.4 29.72,38.71 23.98,38.71 22.25,36.98 22.25,36.37 21.89,36.02 16.46,36.02 v16.26,35.81 | v8.99,35.76 v4.67,35.76
MISO
  Bottom 0.254: 43.28,33.27 43.28,15.75 | U1.16 34.83,38.54 35.86,39.57 37.19,39.57 37.31,39.45
  Bottom 0.406: 37.31,39.45 43.28,33.27 | 43.28,15.75 43.28,5.74 J1.1
MOSI  (via drill 0.6)
  Top 0.406: v35.76,1.32 35.66,3.2 J1.4
  Bottom 0.406: U1.15 34.03,38.45 35.31,40.18 37.64,40.18 44.09,33.73 44.09,15.09 44.15,14.78 44.15,3.91 40.94,0.71 35.76,0.76 v35.76,1.32
MUX1A0
  Bottom 0.152: U$2.11 25.65,43.54 27.86,41.33 27.86,40.03 30.12,40.03 31.62,38.53 U1.12
MUX1A1  (via drill 0.33)
  Top 0.152: v28.98,44.42 30.07,43.33 v30.07,41.38
  Bottom 0.152: v28.98,44.42 27.79,44.42 U$2.10 | v30.07,41.38 32.41,39.04 32.41,37.52 U1.13
MUX1A2  (via drill 0.33)
  Top 0.152: v30.68,43.2 30.94,42.95 v30.94,41.38
  Bottom 0.152: v30.68,43.2 28.63,43.2 28.37,43.46 U$2.9 | v30.94,41.38 30.94,41 33.22,38.71 U1.14
  Bottom 0.406: 28.14,43.5 U$2.9
MUX2A0  (via drill 0.6)
  Top 0.406: v32.51,30.38 32.51,29.21 33.93,27.79 38.76,27.84 39.27,28.4 v39.22,41.5
  Bottom 0.406: U1.1 32.47,30.42 v32.51,30.38 | U$3.11 38.25,42.47 v39.22,41.5
MUX2A1  (via drill 0.6)
  Top 0.406: v32.46,31.9 32.66,31.9 34.34,30.23 34.34,29.31 34.8,28.85 37.59,28.85 38.25,29.52 38.25,43.89 v39.52,45.16
  Bottom 0.406: U1.2 31.78,31.22 v32.46,31.9 | v39.52,45.16 U$3.10
MUX2A2  (via drill 0.6)
  Top 0.406: v29.67,35.71 36.68,35.71 37.29,36.32 37.29,44.35 39.37,46.43 v40.84,46.43
  Bottom 0.406: U1.9 29.23,36.15 v29.67,35.71 | v40.84,46.43 40.84,43.61 U$3.9
N$1  (via drill 0.6)
  Top 0.406: v28.75,14.58 28.75,17.78 v28.24,19
  Bottom 0.406: R2.1 31.94,13.12 30.99,14.07 29.26,14.07 v28.75,14.58 | v28.24,19 28.24,24.69 30.78,26.36 30.78,28.89 U1.30
N$2  (via drill 0.6)
  Top 0.406: v18.14,11.84 18.14,10.62 v21.39,7.37
  Bottom 0.406: U2.2 v18.14,11.83 v18.14,11.84 | v21.39,7.37 23,7.37 C6.1
N$3  (via drill 0.6)
  Top 0.406: v27.48,13.06 27.48,17.68 v27.33,17.83
  Bottom 0.406: R3.1 26.4,11.97 v27.48,13.06 | v27.33,17.83 27.33,25.04 30.02,27.13 U1.31
N$4
  Bottom 0.406: U1.7 26.19,35.22 25.02,34.05
N$5  (via drill 0.6)
  Top 0.406: v17.53,21.79 v17.53,38.1
  Bottom 0.406: R7.1 17.66,21.35 v17.53,21.79 | v17.53,38.1 22.25,38.1 23.72,39.57 29.92,39.57 30.94,38.56 30.94,37.62 U1.11
N$6
  Bottom 0.406: 25.02,36.45 25.57,36.45 26.01,36.02 U1.8
N$7
  Bottom 0.406: U1.20 39.03,33.62 C1.1
N$8
  Top 0.406: LED1.A R1.2
N$9  (via drill 0.6)
  Top 0.406: LED2.A 13.9,12.99 v13.92,13.01
  Bottom 0.406: R7.2 15.66,14.75 v13.92,13.01
N$10  (via drill 0.33)
  Top 0.152: v28.47,40.64 28.47,39.67 24.79,39.67 24.64,39.83 24.64,41.1 14.96,41.1 11.86,44.2 11.86,48.84 7.87,48.84 7.29,48.26 7.29,32.72 4.7,30.12 L5.4-DIN | v39.95,39.4 40.69,40.13 40.69,40.36 L4.2-DOUT
  Bottom 0.152: v28.47,40.64 29.82,41.99 37.36,41.99 v39.95,39.4
N$11
  Top 0.406: L10.2-DOUT 22.34,26.41 L11.4-DIN
N$14
  Top 0.406: L1.2-DOUT 11.55,40.38 L2.4-DIN
N$15
  Top 0.406: L2.2-DOUT 22.34,40.38 L3.4-DIN
N$16
  Top 0.406: L3.2-DOUT 32.5,40.38 L4.4-DIN
N$18
  Top 0.406: L5.2-DOUT 11.55,33.4 L6.4-DIN
N$19
  Top 0.406: L6.2-DOUT 22.34,33.4 L7.4-DIN
N$20
  Top 0.406: L7.2-DOUT 32.5,33.4 L8.4-DIN
N$21  (via drill 0.33, 0.6)
  Top 0.152: 19.76,20.88 19.15,20.88 18.03,19.76
  Top 0.254: L8.2-DOUT v40.18,32.11 | v37.29,25.04 35.05,25.04 32.41,27.69 24.54,27.69 v23.77,26.92 | v21.74,25.15 21.74,22.05 21.03,21.29 20.17,21.29 19.76,20.88 | 18.03,19.76 18.03,19.3 v16.51,17.78 | v6.6,23.11 L9.4-DIN
  Bottom 0.254: v40.18,32.11 40.18,28.04 v37.29,25.04 | v23.77,26.92 23.77,25.81 22.4,25.81 v21.74,25.15 | v16.51,17.78 11.94,17.78 v6.6,23.11
N$22
  Top 0.406: L9.2-DOUT 11.55,26.41 L10.4-DIN
N$24
  Top 0.406: L11.2-DOUT 32.5,26.41 L12.4-DIN
N$25
  Top 0.152: L13.4-DIN 5.41,15.42 18.72,15.42 18.72,19.96 19,20.24 38.02,20.24 38.02,23.27 40.69,25.93 L12.2-DOUT
N$26
  Top 0.406: L13.2-DOUT 11.55,19.43 L14.4-DIN
N$27
  Top 0.406: L14.2-DOUT 22.34,19.43 L15.4-DIN
N$28
  Top 0.406: L15.2-DOUT 32.5,19.43 L16.4-DIN
N$29
  Bottom 0.406: U$4.CIN2(+) 5.35,43.76 2.08,40.49 2.08,38.12 C8.1
RESET  (via drill 0.6)
  Top 0.406: S1.3 S1.4 20.02,2.54 21.44,3.96 v22.86,3.96 | v31.5,24.89 31.6,24.84 v33.68,22.76
  Bottom 0.406: v22.86,3.96 23.01,4.12 C6.2 23.59,5.35 26.67,8.43 30.78,8.43 33.68,11.33 33.68,14.63 | J1.5 40.89,7.57 41.91,9.04 41.91,13.51 40.69,14.63 33.68,14.63 | 33.68,14.63 33.69,16.36 33.63,16.36 | 33.63,16.36 R4.1 | U1.29 31.63,25.08 v31.5,24.89 | v33.68,22.76 33.68,16.41 33.63,16.36
RX
  Bottom 0.406: R2.2 28.73,12.47 27.23,10.97 24.64,10.97 23.98,11.63 23.98,12.24 23.72,12.5 19.7,12.5 U2.1
SCK
  Bottom 0.254: 42.57,32.97 42.52,15.75
  Bottom 0.406: U1.17 39.47,36.02 42.57,32.97 | 42.52,15.75 42.57,13.97 42.57,7.57 J1.3
SCL  (via drill 0.6)
  Top 0.406: v12.6,47.35 12.6,44.5 v12.7,44.4 | v30.07,24.38 v26.21,24.38
  Bottom 0.406: U1.28 32.43,24.06 R6.1 30.89,23.57 v30.07,24.38 | U$4.SCL 13.56,48.3 v12.6,47.35 | v12.7,44.4 12.7,43.33 14.48,41.55 14.48,24.28 15.19,23.57 24.69,23.57 25.5,24.38 v26.21,24.38
SDA  (via drill 0.6)
  Top 0.406: v10.46,48.11 10.46,42.82 v9.86,42.22 | v26.37,20.98 32.66,20.98 33.63,21.13 34.75,21.13 v34.8,21.18
  Bottom 0.406: U1.27 33.23,24.43 34.09,23.57 34.65,23.57 | 34.65,23.57 R5.1 | U$4.SDA 10.27,48.3 v10.46,48.11 | v9.86,42.22 9.86,23.32 10.21,22.76 25.3,22.76 v26.37,20.98 | v34.8,21.18 34.8,23.42 34.65,23.57
TCAP1  (via drill 0.33)
  Top 0.152: v21.21,44.58 20.24,44.58 20.12,44.45 14.76,44.45 14.76,47.4 9.07,53.09 3.96,53.09 U$5.1
  Bottom 0.152: v21.21,44.58 22.1,44.58 U$2.13
TCAP2  (via drill 0.33)
  Top 0.152: U$5.2 v19.86,45.06
  Bottom 0.152: v19.86,45.06 19.86,43 20.17,42.7 21.01,42.7 21.84,43.54 U$2.14
TCAP3  (via drill 0.33)
  Top 0.152: v20.57,46.41 14.12,52.86 U$5.3
  Bottom 0.152: v20.57,46.41 U$2.15
TCAP4  (via drill 0.33)
  Top 0.152: v24.38,45.85 19.2,51.03 U$5.4
  Bottom 0.152: v24.38,45.85 U$2.12
TCAP5  (via drill 0.33)
  Top 0.152: v22.61,52.48 24.28,54.15 U$5.5
  Bottom 0.152: v22.61,52.48 19.3,49.17 U$2.1
TCAP6  (via drill 0.33)
  Top 0.152: v27.08,51.87 29.36,54.15 U$5.6
  Bottom 0.152: v27.08,51.87 24.38,49.17 U$2.5
TCAP7  (via drill 0.33)
  Top 0.152: v33.25,52.48 34.44,53.67 U$5.7
  Bottom 0.152: v33.25,52.48 23.88,52.48 20.57,49.17 U$2.2
TCAP8  (via drill 0.33)
  Top 0.152: v24.79,48.03 25.27,48.51 26.39,48.51 26.39,48.41 30.73,44.07 34.37,44.07 35.76,45.47 35.76,50.04 | 35.66,49.94 35.84,50.11 39.52,53.8 U$5.8
  Top 0.254: 35.76,50.04 35.84,50.11
  Bottom 0.152: v24.79,48.03 24.23,48.03 U$2.4
TX
  Bottom 0.406: U2.5 25.33,9.88 R3.2
USBDM  (via drill 0.6)
  Top 0.406: U$1.D- 9.54,7.15 v9.8,7.11
  Bottom 0.406: v9.8,7.11 9.91,7.16 10.26,6.66 10.26,5.74 11.28,4.72 12.33,4.72 U2.16
USBDP  (via drill 0.6)
  Top 0.406: U$1.D+ 9.25,6.35 9.55,6.04 9.55,4.83 v10.31,4.06
  Bottom 0.406: v10.31,4.06 12.34,4.06 U2.15
V+
  Top 0.406: J2.2 29,8.54 27.43,10.11 23.98,10.11 U3.3 23.96,9.18 23.62,8.84 22.45,8.84 22.1,9.2 22.1,10.09 U3.1
VUSB  (via drill 0.6)
  Top 0.254: U$1.VBUS 10.19,7.95
  Top 0.406: 10.19,7.95 10.82,7.32 19.25,7.32 20.88,5.69 v26.47,5.69 26.52,5.69
  Bottom 0.406: v26.47,5.69 26.49,5.71 D1.A 28.09,4.47 27.79,4.17 24.89,4.17 24.08,3.35 23.06,2.59 21.54,2.23 3.45,2.23 3.05,2.79 3.05,2.85 3.1,2.9 3.1,9.55 4.17,10.62 6.91,10.62 7.77,11.48 C5.1 C4.1

### Text on the board
tPlace: CapGridV1 | UMd Micro Robotics Lab